# EAGLE design LightSensorCircuitNoAmp_BTSeriesHookup - Copy (EAGLE 9.6.2)
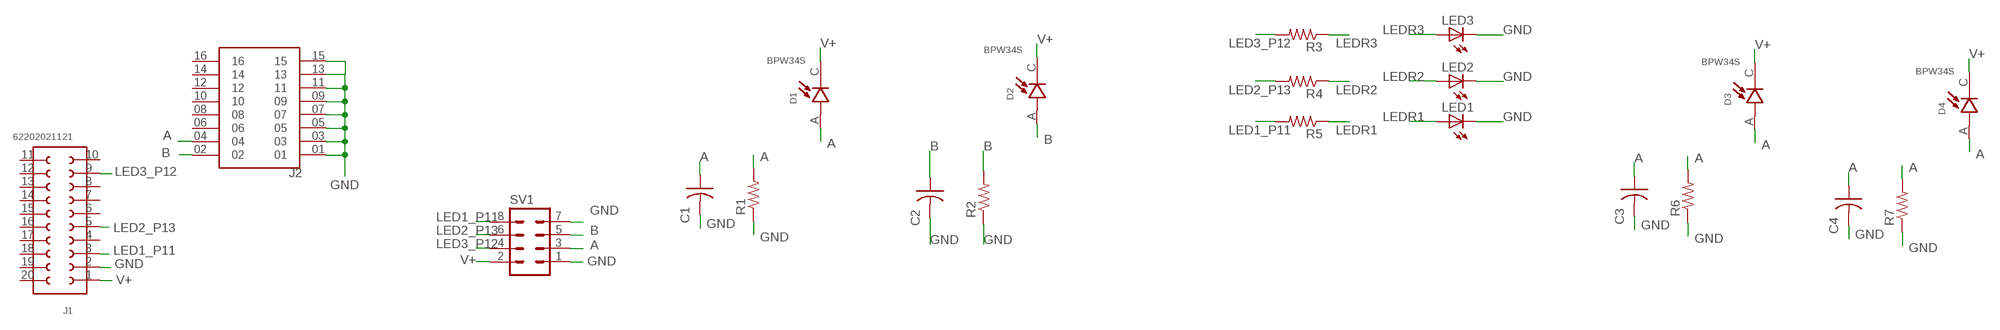
[diagram p0: schematic, sheet 1]

## Parts
C1  C-US025-025X050  [C025-025X050]
C2  C-US025-025X050  [C025-025X050]
C3  C-US025-025X050  [C025-025X050]
C4  C-US025-025X050  [C025-025X050]
D1  BPW34S  [DIO_BPW34S]
D2  BPW34S  [DIO_BPW34S]
D3  BPW34S  [DIO_BPW34S]
D4  BPW34S  [DIO_BPW34S]
J1  62202021121  [62202021121]
J2  FTSH-108-02-LM-D-ES  [SAMTEC_FTSH-108-02-LM-D-ES]
LED1  LEDCHIPLED_1206  [CHIPLED_1206]
LED2  LEDCHIPLED_1206  [CHIPLED_1206]
LED3  LEDCHIPLED_1206  [CHIPLED_1206]
R1  R-US_0204/5  [0204/5]
R2  R-US_0204/5  [0204/5]
R3  R-US_0204/5  [0204/5]
R4  R-US_0204/5  [0204/5]
R5  R-US_0204/5  [0204/5]
R6  R-US_0204/5  [0204/5]
R7  R-US_0204/5  [0204/5]
SV1  MA04-2  [MA04-2]

## Nets
A: C1.1 C3.1 C4.1 D1.A D3.A D4.A J2.04 R1.2 R6.2 R7.2 SV1.3
B: C2.1 D2.A J2.02 R2.2 SV1.5
GND: C1.2 C2.2 C3.2 C4.2 J1.2 J2.01 J2.03 J2.05 J2.07 J2.09 J2.11 J2.13 J2.15 LED1.C LED2.C LED3.C R1.1 R2.1 R6.1 R7.1 SV1.1 SV1.7
LED1_P11: J1.3 R5.2 SV1.8
LED2_P13: J1.5 R4.2 SV1.6
LED3_P12: J1.9 R3.2 SV1.4
LEDR1: LED1.A R5.1
LEDR2: LED2.A R4.1
LEDR3: LED3.A R3.1
V+: D1.C D2.C D3.C D4.C J1.1 SV1.2
Unconnected: J1.4 J1.6 J1.7 J1.8 J1.10 J1.11 J1.12 J1.13 J1.14 J1.15 J1.16 J1.17 J1.18 J1.19 J1.20 J2.06 J2.08 J2.10 J2.12 J2.14 J2.16

## Library data of the parts
C1-C4 = adafruit:C-US: CAPACITOR, American symbol
D1-D4 = BPW34S:BPW34S: PHOTODIODE; Wavelength Typ: 850nm; Sensitivity: 0.62A/W; Half Angle: 60°; Dark Current: 2nA; No. of Pins: 2; Check availability <https://pricing.snapeda.com/parts/BPW34S/Vishay%20Semiconductor%20Opto%20Division/view-part?ref=eda>; AVAILABILITY: In Stock; DESCRIPTION: Photodiode 900nm - 130° 2-DIP; MF: Vishay Semiconductor Opto Division; MP: BPW34S; PACKAGE: None; PRICE: None; PURCHASE-URL: https://pricing.snapeda.com/search/part/BPW34S/?ref=eda
J1 = 2x10_1.27mm:62202021121: WR-PHD 1.27mm Dual Pin Header, 20 Pins=>Code : Con_BTB_PHD_1.27_2_62202021121 <http://katalog.we-online.de/media/thumbs2/eican/thb_Con_BTB_PHD_1.27_2_6220xx21121_pf2.jpg> Details see: http://katalog.we-online.de/en/em/622_0xx_211_21 Created 2014-06-03, Karrer Zheng 2014 (C) Würth Elektronik Check availability <https://pricing.snapeda.com/parts/62202021121/W%C3%BCrth%20Elektronik/view-part?ref=eda>; AVAILABILITY: In Stock; DESCRIPTION: Connector Header Through Hole 20 position 0.050 (1.27mm); MF: Würth Elektronik; MP: 62202021121; PACKAGE: None; PRICE: None; PURCHASE-URL: https://pricing.snapeda.com/search/part/62202021121/?ref=eda
J2 = 16pos1.27mm:FTSH-108-02-LM-D-ES: Check availability <https://pricing.snapeda.com/parts/FTSH-108-02-LM-D-ES/Samtec/view-part?ref=eda>; AVAILABILITY: In Stock; DESCRIPTION: Connector Header Through Hole 16 position 0.050 (1.27mm); MF: Samtec; MP: FTSH-108-02-LM-D-ES; PACKAGE: None; PRICE: None; PURCHASE-URL: https://pricing.snapeda.com/search?q=FTSH-108-02-LM-D-ES&ref=eda
LED1-LED3 = adafruit:LED: LED OSRAM: - CHIPLED LG R971, LG N971, LY N971, LG Q971, LY Q971, LO R971, LY R971 LH N974, LH R974 LS Q976, LO Q976, LY Q976 LO Q996 - Hyper CHIPLED LW Q18S LB Q993, LB Q99A, LB R99A - SideLED LS A670, LO A670, LY A670, LG A670, LP A670 LB A673, LV A673, LT A673, LW A673 LH A674 LY A675 LS A676, LA A676, LO A676, LY A676, LW A676 LS A679, LY A679, LG A679 - Hyper Micro SIDELED® LS Y876, LA Y876, LO Y876, LY Y876 LT Y87S - SmartLED LW L88C, LW L88S LB L89C, LB L89S, LG L890 LS L89K, LO L89K, LY L89K LS L896, LA L896, LO L896, LY L896 - TOPLED LS T670, LO T670, LY T670, LG T670, LP T670 LSG T670, LSP T670, LSY T670, LOP T670, LYG T670 LG T671, LOG T671, LSG T671 LB T673, LV T673, LT T673, LW T673 LH T674 LS T676, LA T676, LO T676, LY T676, LB T676, LH T676, LSB T676, LW T676 LB T67C, LV T67C, LT T67C, LS T67K, LO T67K, LY T67K, LW E67C LS E67B, LA E67B, LO E67B, LY E67B, LB E67C, LV E67C, LT E67C LW T67C LS T679, LY T679, LG T679 LS T770, LO T770, LY T770, LG T770, LP T770 LB T773, LV T773, LT T773, LW T773 LH T774 LS E675, LA E675, LY E675, LS T675 LS T776, LA T776, LO T776, LY T776, LB T776 LHGB T686 LT T68C, LB T68C - Hyper Mini TOPLED® LB M676 - Mini TOPLED Santana® LG M470 LS M47K, LO M47K, LY M47K Source: http://www.osram.convergy.de/
R1-R7 = adafruit:R-US_: RESISTOR, American symbol
SV1 = con-lstb:MA04-2: PIN HEADER; OC_FARNELL: unknown; OC_NEWARK: unknown

## Board
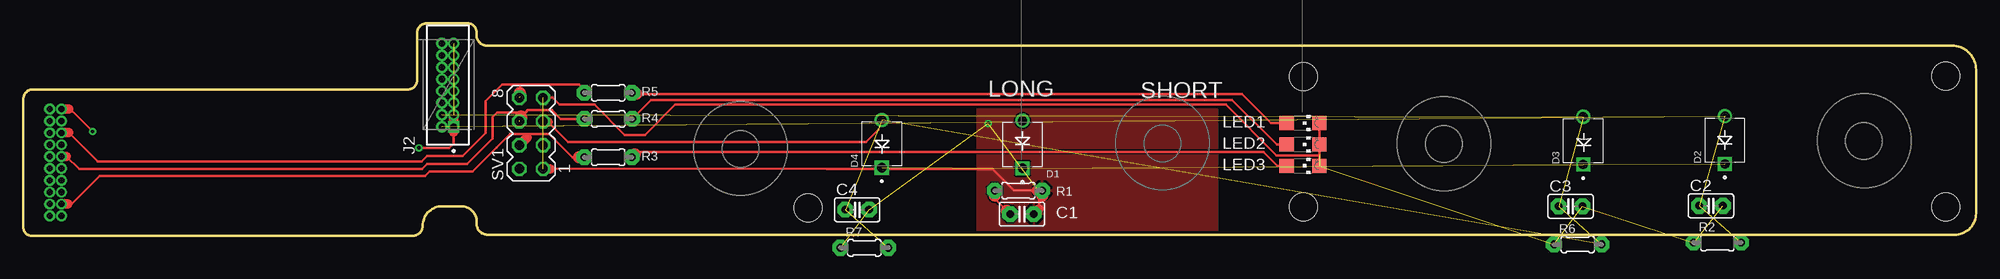
[diagram p1: board, top side]
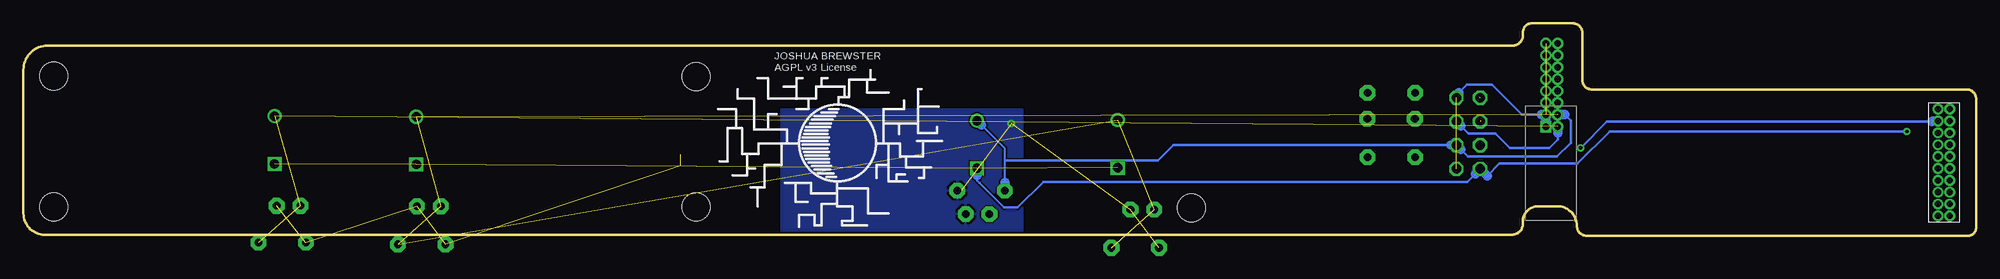
[diagram p2: board, bottom side, seen from below]

Size 208.56 x 22.73 mm. Coordinates in mm from the lower left corner, seen from the top.
Outline: 208.56,17.78 208.56,2.41 arc-90 206.27,0.13 49.56,0.13 arc-90 48.41,1.27 48.41,1.52 arc90 46.76,3.18 44.73,3.18 arc90 42.65,1.09 arc-90 41.53,0 0.89,0 arc-90 0,0.89 0,14.66 arc-90 1.02,15.67 41.07,15.67 arc90 42.06,16.66 42.06,21.72 arc-90 43.08,22.73 47.47,22.73 arc-90 48.39,21.82 48.39,21.51 arc90 49.56,20.34 205.99,20.34 arc-90 208.56,17.78
Copper layers (1*16): Top 0.035mm / dielectric 1.5mm / Bottom 0.035mm
Design rules "default *": minimum track width 6mil, minimum drill 0.35mm, track to track 6mil, track to pad 6mil, pad to pad 6mil, via to via 6mil, smd to smd 6mil, copper to edge 10mil, drill to drill 6mil, minimum pad ring 10mil, minimum via ring 8mil, stop-mask expansion 4mil, vias tented up to drill 0mil, thermal gap 10mil
Holes 3 mm at 136.7,17.02 136.73,3.12 83.82,3 205.31,3.12 205.31,17.09

### Footprints (pad centres in the part's own frame; a part is rotated, then mirrored left to right if it is on the bottom)
C025-025X050 = drill 0.813 pad 1.676 octagon: 1 -1.27,0; 2 1.27,0
DIO_BPW34S = drill 1 pad 1.5: A 2.55,0 | drill 1 pad 1.5 square: C -2.55,0
62202021121 = drill 0.65: 1 -5.715,-0.635; 2 -4.445,-0.635; 3 -3.175,-0.635; 4 -1.905,-0.635; 5 -0.635,-0.635; 6 0.635,-0.635; 7 1.905,-0.635; 8 3.175,-0.635; 9 4.445,-0.635; 10 5.715,-0.635; 11 5.715,0.635; 12 4.445,0.635; 13 3.175,0.635; 14 1.905,0.635; 15 0.635,0.635; 16 -0.635,0.635; 17 -1.905,0.635; 18 -3.175,0.635; 19 -4.445,0.635; 20 -5.715,0.635
SAMTEC_FTSH-108-02-LM-D-ES = drill 0.71 pad 1.06 square: 01 0,0 | drill 0.71 pad 1.06: 02 0,1.27; 03 1.27,0; 04 1.27,1.27; 05 2.54,0; 06 2.54,1.27; 07 3.81,0; 08 3.81,1.27; 09 5.08,0; 10 5.08,1.27; 11 6.35,0; 12 6.35,1.27; 13 7.62,0; 14 7.62,1.27; 15 8.89,0; 16 8.89,1.27
CHIPLED_1206 = smd 1.5 x 1.5: A 0,-1.75; C 0,1.75
0204/5 = drill 0.813 pad 1.676 octagon: 1 -2.54,0; 2 2.54,0
MA04-2 = drill 1.016 octagon: 1 -3.81,-1.27; 2 -3.81,1.27; 3 -1.27,-1.27; 4 -1.27,1.27; 5 1.27,-1.27; 6 1.27,1.27; 7 3.81,-1.27; 8 3.81,1.27

### Placement (x,y rotation side)
C1  106.65,2.34 0 top
C2  180.24,3.22 0 top
C3  165.25,3.16 0 top
C4  89.05,2.79 0 top
D1  106.71,9.78 90 top
D2  181.73,10.25 90 top
D3  166.59,10.19 90 top
D4  91.68,9.85 90 top
J1  3.43,7.85 270 bottom
J2  45.95,11.68 90 top
LED1  136.68,12.07 270 top
LED2  136.68,9.78 270 top
LED3  136.68,7.49 270 top
R1  106.27,4.85 180 top
R2  180.93,-0.72 0 top
R3  62.46,8.41 180 top
R4  62.47,12.51 180 top
R5  62.46,15.32 180 top
R6  166.01,-0.9 0 top
R7  89.81,-1.27 0 top
SV1  54.23,10.97 90 top

### Tracks (layer width: path | path; a pad name or v marks a point on that pad's centre or on a via)
A  (6 unrouted)
  Top 0.254: 105.03,2.69 103.73,3.99 103.73,4.29
  Top 1.27: C1.1 105.03,2.69 | R1.2 103.73,4.29
  Bottom 0.203: 106.24,11.87 103.73,9.36 103.73,8.05 103.73,5.71
  Bottom 0.254: 103.73,8.05 87.4,8.05 85.75,9.7 56.11,9.7 | 55.02,9.22 54.28,8.48 44.78,8.48 43.31,9.96 43.31,12.34 43.92,12.95
  Bottom 1.016: D1.A 106.24,11.87 | R1.2 103.73,5.71 | 56.11,9.7 SV1.3 55.02,9.22 | J2.04 43.92,12.95
B  (3 unrouted)
  Top 0.254: 91.35,11.39 90.02,10.06 58.19,10.06 56.06,12.19
  Top 1.016: 56.06,12.19 55.55,12.19 SV1.5
  Bottom 0.254: 44.68,11.02 44.68,10.29 45.57,9.4 49.78,9.4 51.33,10.95 54.2,10.95 55.02,11.76
  Bottom 1.016: SV1.5 55.02,11.76 | J2.02 44.68,11.02
GND  (via drill 0.35)  (15 unrouted)
  Top 0.203: 85.8,7.16 56.26,7.16
  Top 0.254: LED3.C 138.43,8.62 133.84,8.62 128.42,14.04 69.62,14.04 66.38,10.8 64.23,10.8 60.99,14.04 57.26,14.04 56.52,14.78 SV1.7 | 138.43,8.7 LED2.C LED1.C | 85.8,7.16 103.51,7.16 105.82,4.85 107.59,4.85 R1.1 | 108.81,4.32 108.46,3.96 108.46,2.92 108.48,2.9 | 45.95,11.1 45.95,9.91 45.47,9.42 v42.24,9.42
  Top 1.016: 56.26,7.16 SV1.1 | C1.2 108.48,2.9 | J2.03 J2.01 45.95,11.1
  Top 1.27: 108.36,4.85 R1.1 108.81,4.32
  Bottom 0.254: v42.24,9.42 39.45,12.22 4.72,12.22 | 46.41,12.95 48.49,12.95 51.71,16.18 54.38,16.18 55.26,15.3
  Bottom 1.016: 46.41,12.95 J2.03 45.95,12.93 J2.01 | SV1.7 55.26,15.02 55.26,15.3 | J1.2 4.65,12.29 4.72,12.22
  other vias: 103.05,12.04
  pour Bottom: 101.83,-1.57 127.63,-1.57 127.63,13.59 101.83,13.59
  pour Top: 101.85,-1.5 101.85,13.56 105.79,13.56 127.53,13.56 127.53,8.03 127.53,-1.5
LED1_P11  (1 unrouted)
  Top 0.254: 60.11,15.44 59.34,16.21 53.04,16.21 | 53.04,15.29 53.04,16.21 | 53.04,16.21 51.16,16.21 49.38,14.43 49.38,11 46.91,8.53 43.1,8.53 42.55,7.98 7.92,7.98 4.85,11.05
  Top 1.016: J1.3 4.09,11.05 4.85,11.05
  Top 1.27: 53.04,15.29 53.04,14.86 | R5.2 60.05,15.44 60.11,15.44
LED2_P13  (1 unrouted)
  Top 0.254: R4.2 57.39,12.51 56.47,13.44 53.87,13.44 53.62,13.18 | 53.14,12.8 53.24,12.8 53.62,13.18 | 53.62,13.18 50.57,13.18 50.11,12.73 50.11,10.41 47.37,7.67 43.1,7.67 42.57,7.14 5.97,7.14 4.6,8.51
  Top 1.016: J1.5 4.09,8.51 4.6,8.51
  Top 1.27: 52.96,12.32 53.14,12.5 53.14,12.8
LED3_P12  (1 unrouted)
  Top 0.254: 53.8,10.54 54.15,10.9 | R3.2 58.65,8.41 56.16,10.9 54.15,10.9 | 54.15,10.9 51.97,10.9 50.55,9.47 | 50.52,9.45 47.98,6.91 43.38,6.91 42.9,6.43 8.15,6.43 5.16,3.43 4.72,3.43
  Top 1.016: SV1.4 53.8,10.54 | J1.9 4.09,3.43 4.72,3.43
  Top 1.27: R3.2 59.33,8.41 59.32,8.43
LEDR1
  Top 0.254: LED1.A 133.25,12.07 130.12,15.19 65.46,15.19
  Top 1.27: 65.46,15.19 65.26,15.39 65.08,15.39 R5.1
LEDR2
  Top 0.254: R4.1 67.05,14.54 129.09,14.54 133.86,9.78 LED2.A
LEDR3
  Top 0.254: LED3.A 133.93,7.49 132.45,8.98 65.56,8.98 65.3,8.71
  Top 1.27: R3.1 65.3,8.71
V+  (via drill 0.35)  (3 unrouted)
  Top 0.254: v7.39,11.18 5,13.56 4.85,13.56
  Top 1.016: J1.1 4.85,13.56
  Bottom 0.254: 106.71,6.45 106.71,5.94 106.44,5.68 103.81,3.05 102.36,3.05 99.63,5.78 54.34,5.78 53.51,6.62 | 52.21,6.41 50.9,7.72 42.6,7.72 39.14,11.18 v7.39,11.18
  Bottom 1.016: D1.C 106.71,6.45 | 53.51,6.62 SV1.2 52.21,6.41

### Text on the board
tPlace: LONG | SHORT
bNames: JOSHUA BREWSTER / AGPL v3 License
tDocu: The fat wires leading off the pin holes are for durability / as some copper stays under the coverlay and is more / heat resistant for soldering.